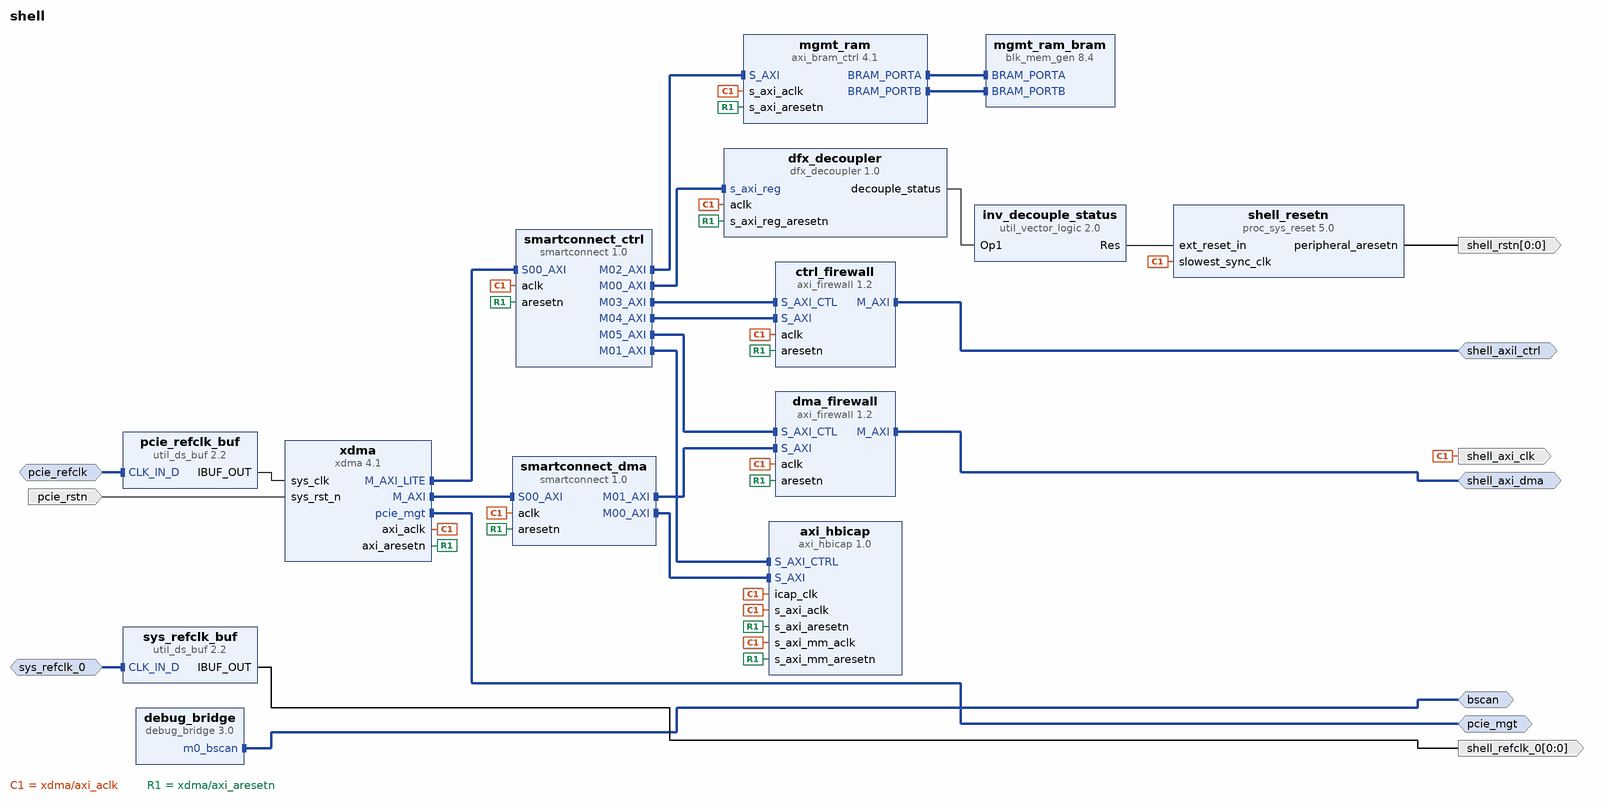
[diagram p0: block diagram of the top level]
# Vivado block design shell, xc7a200tfbg484-2, Vivado 2022.2
create_bd_design shell

create_bd_intf_port -mode Master -vlnv xilinx.com:interface:pcie_7x_mgt_rtl:1.0 pcie_mgt
create_bd_intf_port -mode Slave -vlnv xilinx.com:interface:diff_clock_rtl:1.0 pcie_refclk
create_bd_intf_port -mode Master -vlnv xilinx.com:interface:bscan_rtl:1.0 bscan
create_bd_intf_port -mode Master -vlnv xilinx.com:interface:aximm_rtl:1.0 shell_axi_dma
set_property -dict [list \
  CONFIG.ADDR_WIDTH 64 \
  CONFIG.DATA_WIDTH 128 \
  CONFIG.HAS_REGION 0 \
  CONFIG.NUM_READ_OUTSTANDING 32 \
  CONFIG.NUM_WRITE_OUTSTANDING 16 \
  CONFIG.PROTOCOL AXI4 \
] [get_bd_intf_ports shell_axi_dma]
create_bd_intf_port -mode Master -vlnv xilinx.com:interface:aximm_rtl:1.0 shell_axil_ctrl
set_property -dict [list \
  CONFIG.ADDR_WIDTH 32 \
  CONFIG.DATA_WIDTH 32 \
  CONFIG.HAS_BURST 0 \
  CONFIG.HAS_CACHE 0 \
  CONFIG.HAS_LOCK 0 \
  CONFIG.HAS_QOS 0 \
  CONFIG.HAS_REGION 0 \
  CONFIG.PROTOCOL AXI4LITE \
] [get_bd_intf_ports shell_axil_ctrl]
create_bd_intf_port -mode Slave -vlnv xilinx.com:interface:diff_clock_rtl:1.0 sys_refclk_0
set_property -dict {CONFIG.FREQ_HZ 200000000} [get_bd_intf_ports sys_refclk_0]
create_bd_port -dir I -type rst pcie_rstn
create_bd_port -dir O -type clk shell_axi_clk
set_property -dict {CONFIG.ASSOCIATED_BUSIF shell_axi_dma:shell_axil_ctrl} [get_bd_ports shell_axi_clk]
create_bd_port -dir O -from 0 -to 0 -type clk shell_refclk_0
create_bd_port -dir O -from 0 -to 0 -type rst shell_rstn
set_property -dict {CONFIG.POLARITY ACTIVE_LOW} [get_bd_ports shell_rstn]

create_bd_cell -type ip -vlnv xilinx.com:ip:xdma:4.1 xdma
set_property -dict [list \
  CONFIG.axi_data_width 128_bit \
  CONFIG.axilite_master_en true \
  CONFIG.axilite_master_size 128 \
  CONFIG.cfg_mgmt_if false \
  CONFIG.pf0_Use_Class_Code_Lookup_Assistant true \
  CONFIG.pf0_base_class_menu Processors \
  CONFIG.pf0_device_id 9038 \
  CONFIG.pf0_sub_class_interface_menu Co_processor \
  CONFIG.pl_link_cap_max_link_speed 5.0_GT/s \
  CONFIG.pl_link_cap_max_link_width X4 \
] [get_bd_cells xdma]
create_bd_cell -type ip -vlnv xilinx.com:ip:util_ds_buf:2.2 pcie_refclk_buf
set_property -dict {CONFIG.C_BUF_TYPE IBUFDSGTE} [get_bd_cells pcie_refclk_buf]
create_bd_cell -type ip -vlnv xilinx.com:ip:axi_hbicap:1.0 axi_hbicap
set_property -dict [list \
  CONFIG.C_INCLUDE_STARTUP 1 \
  CONFIG.C_OPERATION 0 \
  CONFIG.C_READ_DELAY 0 \
  CONFIG.C_READ_FIFO_DEPTH 64 \
  CONFIG.C_READ_PATH 0 \
  CONFIG.C_WRITE_FIFO_DEPTH 512 \
] [get_bd_cells axi_hbicap]
create_bd_cell -type ip -vlnv xilinx.com:ip:smartconnect:1.0 smartconnect_ctrl
set_property -dict {CONFIG.NUM_MI 6 CONFIG.NUM_SI 1} [get_bd_cells smartconnect_ctrl]
create_bd_cell -type ip -vlnv xilinx.com:ip:smartconnect:1.0 smartconnect_dma
set_property -dict {CONFIG.NUM_MI 2 CONFIG.NUM_SI 1} [get_bd_cells smartconnect_dma]
create_bd_cell -type ip -vlnv xilinx.com:ip:axi_bram_ctrl:4.1 mgmt_ram
create_bd_cell -type ip -vlnv xilinx.com:ip:blk_mem_gen:8.4 mgmt_ram_bram
set_property -dict {CONFIG.Memory_Type True_Dual_Port_RAM} [get_bd_cells mgmt_ram_bram]
create_bd_cell -type ip -vlnv xilinx.com:ip:debug_bridge:3.0 debug_bridge
set_property -dict [list \
  CONFIG.C_DEBUG_MODE 7 \
  CONFIG.C_DESIGN_TYPE 0 \
  CONFIG.C_NUM_BS_MASTER 1 \
  CONFIG.C_USER_SCAN_CHAIN 2 \
] [get_bd_cells debug_bridge]
create_bd_cell -type ip -vlnv xilinx.com:ip:axi_firewall:1.2 ctrl_firewall
set_property -dict [list \
  CONFIG.ADDR_WIDTH 32 \
  CONFIG.DATA_WIDTH 32 \
  CONFIG.HAS_BRESP 1 \
  CONFIG.HAS_BURST 0 \
  CONFIG.HAS_CACHE 0 \
  CONFIG.HAS_LOCK 0 \
  CONFIG.HAS_PROT 1 \
  CONFIG.HAS_QOS 0 \
  CONFIG.HAS_REGION 0 \
  CONFIG.HAS_RRESP 1 \
  CONFIG.HAS_WSTRB 1 \
  CONFIG.PROTOCOL AXI4LITE \
] [get_bd_cells ctrl_firewall]
create_bd_cell -type ip -vlnv xilinx.com:ip:axi_firewall:1.2 dma_firewall
set_property -dict {CONFIG.ADDR_WIDTH 64 CONFIG.DATA_WIDTH 128 CONFIG.HAS_REGION 0} [get_bd_cells dma_firewall]
create_bd_cell -type ip -vlnv xilinx.com:ip:util_ds_buf:2.2 sys_refclk_buf
create_bd_cell -type ip -vlnv xilinx.com:ip:dfx_decoupler:1.0 dfx_decoupler
set_property -dict {CONFIG.ALL_PARAMS {HAS_AXI_LITE 1 HAS_SIGNAL_CONTROL 0}} [get_bd_cells dfx_decoupler]
create_bd_cell -type ip -vlnv xilinx.com:ip:util_vector_logic:2.0 inv_decouple_status
set_property -dict {CONFIG.C_OPERATION not CONFIG.C_SIZE 1} [get_bd_cells inv_decouple_status]
create_bd_cell -type ip -vlnv xilinx.com:ip:proc_sys_reset:5.0 shell_resetn

# ---- connections ----

connect_bd_intf_net -intf_net CLK_IN_D_0_1 [get_bd_intf_ports pcie_refclk] [get_bd_intf_pins pcie_refclk_buf/CLK_IN_D]
connect_bd_intf_net -intf_net CLK_IN_D_0_2 [get_bd_intf_ports sys_refclk_0] [get_bd_intf_pins sys_refclk_buf/CLK_IN_D]
connect_bd_intf_net [get_bd_intf_ports shell_axil_ctrl] [get_bd_intf_pins ctrl_firewall/M_AXI]
connect_bd_intf_net [get_bd_intf_ports bscan] [get_bd_intf_pins debug_bridge/m0_bscan]
connect_bd_intf_net [get_bd_intf_ports shell_axi_dma] [get_bd_intf_pins dma_firewall/M_AXI]
connect_bd_intf_net [get_bd_intf_pins mgmt_ram_bram/BRAM_PORTA] [get_bd_intf_pins mgmt_ram/BRAM_PORTA]
connect_bd_intf_net [get_bd_intf_pins mgmt_ram_bram/BRAM_PORTB] [get_bd_intf_pins mgmt_ram/BRAM_PORTB]
connect_bd_intf_net [get_bd_intf_pins smartconnect_ctrl/M00_AXI] [get_bd_intf_pins dfx_decoupler/s_axi_reg]
connect_bd_intf_net [get_bd_intf_pins smartconnect_ctrl/M01_AXI] [get_bd_intf_pins axi_hbicap/S_AXI_CTRL]
connect_bd_intf_net [get_bd_intf_pins smartconnect_ctrl/M02_AXI] [get_bd_intf_pins mgmt_ram/S_AXI]
connect_bd_intf_net [get_bd_intf_pins smartconnect_ctrl/M03_AXI] [get_bd_intf_pins ctrl_firewall/S_AXI_CTL]
connect_bd_intf_net [get_bd_intf_pins smartconnect_ctrl/M04_AXI] [get_bd_intf_pins ctrl_firewall/S_AXI]
connect_bd_intf_net [get_bd_intf_pins smartconnect_ctrl/M05_AXI] [get_bd_intf_pins dma_firewall/S_AXI_CTL]
connect_bd_intf_net [get_bd_intf_pins smartconnect_dma/M00_AXI] [get_bd_intf_pins axi_hbicap/S_AXI]
connect_bd_intf_net [get_bd_intf_pins smartconnect_dma/M01_AXI] [get_bd_intf_pins dma_firewall/S_AXI]
connect_bd_intf_net [get_bd_intf_pins smartconnect_dma/S00_AXI] [get_bd_intf_pins xdma/M_AXI]
connect_bd_intf_net [get_bd_intf_pins smartconnect_ctrl/S00_AXI] [get_bd_intf_pins xdma/M_AXI_LITE]
connect_bd_intf_net [get_bd_intf_ports pcie_mgt] [get_bd_intf_pins xdma/pcie_mgt]
connect_bd_net [get_bd_pins dfx_decoupler/decouple_status] [get_bd_pins inv_decouple_status/Op1]
connect_bd_net [get_bd_pins inv_decouple_status/Res] [get_bd_pins shell_resetn/ext_reset_in]
connect_bd_net [get_bd_pins shell_resetn/peripheral_aresetn] [get_bd_ports shell_rstn]
connect_bd_net [get_bd_pins sys_refclk_buf/IBUF_OUT] [get_bd_ports shell_refclk_0]
connect_bd_net -net sys_rst_n_0_1 [get_bd_ports pcie_rstn] [get_bd_pins xdma/sys_rst_n]
connect_bd_net -net util_ds_buf_0_IBUF_OUT [get_bd_pins pcie_refclk_buf/IBUF_OUT] [get_bd_pins xdma/sys_clk]
connect_bd_net [get_bd_pins xdma/axi_aclk] \
  [get_bd_pins smartconnect_dma/aclk] [get_bd_pins smartconnect_ctrl/aclk] [get_bd_pins axi_hbicap/s_axi_mm_aclk] \
  [get_bd_pins axi_hbicap/s_axi_aclk] [get_bd_pins mgmt_ram/s_axi_aclk] [get_bd_pins ctrl_firewall/aclk] \
  [get_bd_ports shell_axi_clk] [get_bd_pins dma_firewall/aclk] [get_bd_pins dfx_decoupler/aclk] \
  [get_bd_pins shell_resetn/slowest_sync_clk] [get_bd_pins axi_hbicap/icap_clk]
connect_bd_net [get_bd_pins xdma/axi_aresetn] \
  [get_bd_pins smartconnect_ctrl/aresetn] [get_bd_pins smartconnect_dma/aresetn] [get_bd_pins axi_hbicap/s_axi_aresetn] \
  [get_bd_pins axi_hbicap/s_axi_mm_aresetn] [get_bd_pins mgmt_ram/s_axi_aresetn] [get_bd_pins ctrl_firewall/aresetn] \
  [get_bd_pins dma_firewall/aresetn] [get_bd_pins dfx_decoupler/s_axi_reg_aresetn]

# ---- address map ----
assign_bd_address -offset 0x0000000000000000 -range 256T -target_address_space [get_bd_addr_spaces xdma/M_AXI] [get_bd_addr_segs shell_axi_dma/Reg]
assign_bd_address -offset 0x1000000000000000 -range 1G -target_address_space [get_bd_addr_spaces xdma/M_AXI] [get_bd_addr_segs axi_hbicap/S_AXI/Mem0]
assign_bd_address -offset 0x00000000 -range 64M -target_address_space [get_bd_addr_spaces xdma/M_AXI_LITE] [get_bd_addr_segs shell_axil_ctrl/Reg]
assign_bd_address -offset 0x04050000 -range 64K -target_address_space [get_bd_addr_spaces xdma/M_AXI_LITE] [get_bd_addr_segs axi_hbicap/S_AXI_CTRL/Reg0]
assign_bd_address -offset 0x04060000 -range 8K -target_address_space [get_bd_addr_spaces xdma/M_AXI_LITE] [get_bd_addr_segs mgmt_ram/S_AXI/Mem0]
assign_bd_address -offset 0x04070000 -range 64K -target_address_space [get_bd_addr_spaces xdma/M_AXI_LITE] [get_bd_addr_segs ctrl_firewall/S_AXI_CTL/Control]
assign_bd_address -offset 0x04080000 -range 64K -target_address_space [get_bd_addr_spaces xdma/M_AXI_LITE] [get_bd_addr_segs dma_firewall/S_AXI_CTL/Control]
assign_bd_address -offset 0x04090000 -range 64K -target_address_space [get_bd_addr_spaces xdma/M_AXI_LITE] [get_bd_addr_segs dfx_decoupler/s_axi_reg/Reg]

validate_bd_design
save_bd_design
